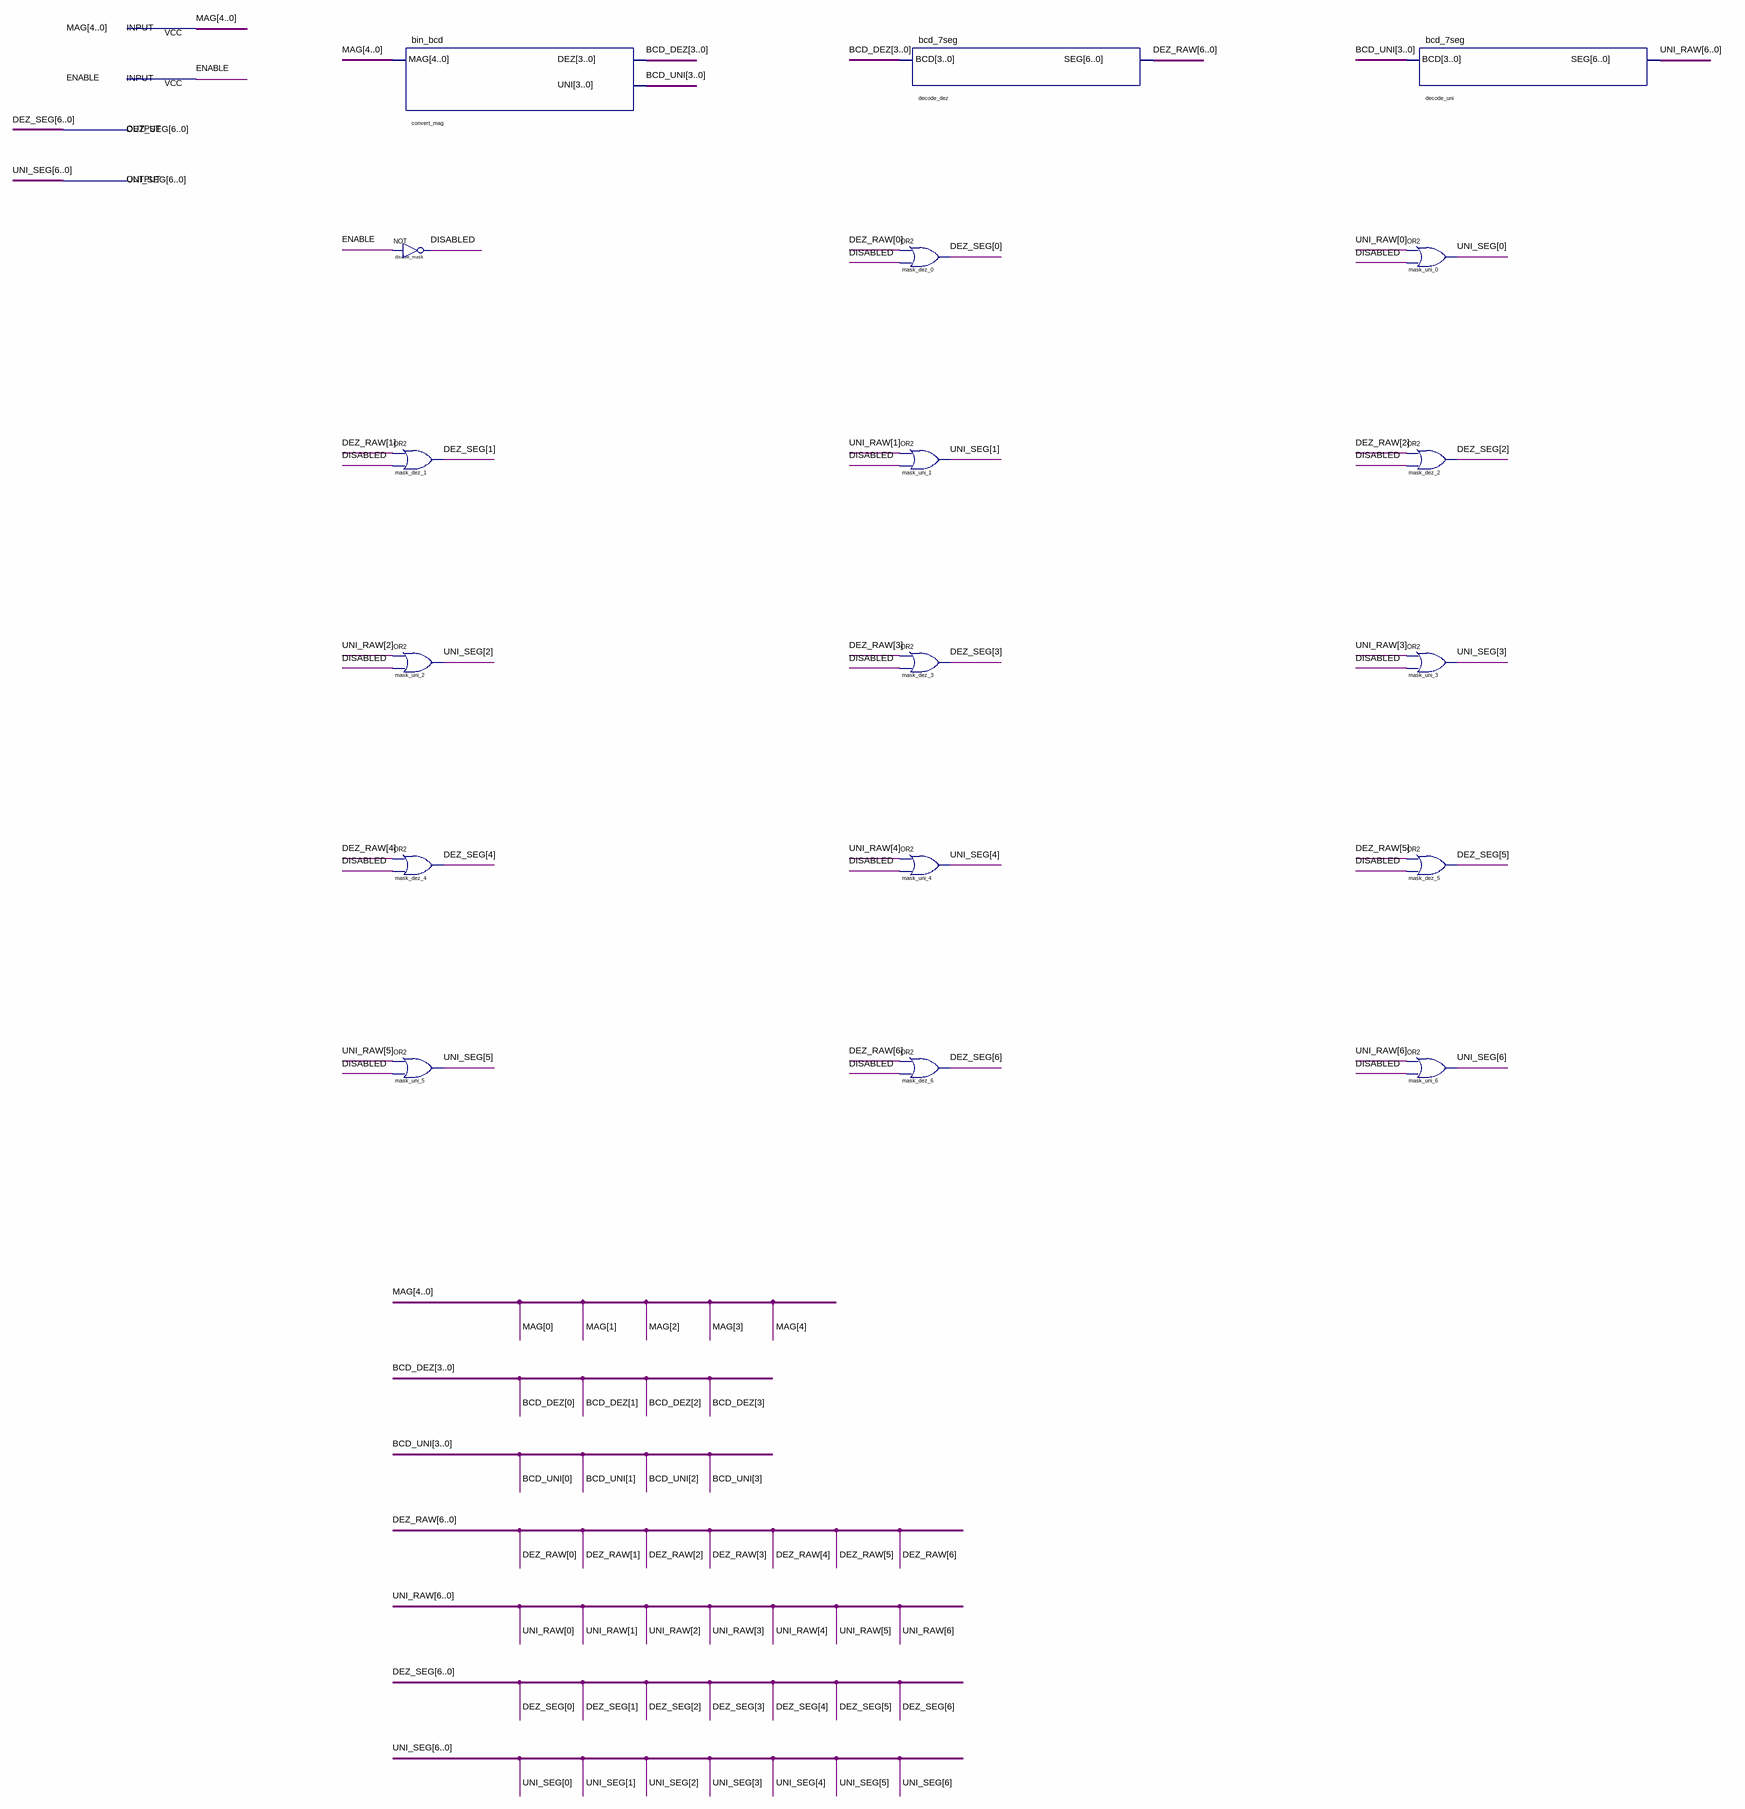
[diagram p0: schematic sheet]
// Quartus schematic display_decimal_2digitos.bdf as structural Verilog: 18 symbols, 4 pins
module display_decimal_2digitos (
  input  [4:0] MAG,
  input  ENABLE,
  output [6:0] DEZ_SEG,
  output [6:0] UNI_SEG
);

  wire DISABLED;
  wire [3:0] BCD_DEZ, BCD_UNI;
  wire [6:0] DEZ_RAW, UNI_RAW;

  bin_bcd convert_mag (.MAG(MAG), .DEZ(BCD_DEZ), .UNI(BCD_UNI));
  not disable_mask (DISABLED, ENABLE);
  or mask_dez_1 (DEZ_SEG[1], DEZ_RAW[1], DISABLED);
  or mask_uni_2 (UNI_SEG[2], UNI_RAW[2], DISABLED);
  or mask_dez_4 (DEZ_SEG[4], DEZ_RAW[4], DISABLED);
  or mask_uni_5 (UNI_SEG[5], UNI_RAW[5], DISABLED);
  bcd_7seg decode_dez (.BCD(BCD_DEZ), .SEG(DEZ_RAW));
  or mask_dez_0 (DEZ_SEG[0], DEZ_RAW[0], DISABLED);
  or mask_uni_1 (UNI_SEG[1], UNI_RAW[1], DISABLED);
  or mask_dez_3 (DEZ_SEG[3], DEZ_RAW[3], DISABLED);
  or mask_uni_4 (UNI_SEG[4], UNI_RAW[4], DISABLED);
  or mask_dez_6 (DEZ_SEG[6], DEZ_RAW[6], DISABLED);
  bcd_7seg decode_uni (.BCD(BCD_UNI), .SEG(UNI_RAW));
  or mask_uni_0 (UNI_SEG[0], UNI_RAW[0], DISABLED);
  or mask_dez_2 (DEZ_SEG[2], DEZ_RAW[2], DISABLED);
  or mask_uni_3 (UNI_SEG[3], UNI_RAW[3], DISABLED);
  or mask_dez_5 (DEZ_SEG[5], DEZ_RAW[5], DISABLED);
  or mask_uni_6 (UNI_SEG[6], UNI_RAW[6], DISABLED);
endmodule
